# Altium schematic sheet Power_supplies.SchDoc
size A4
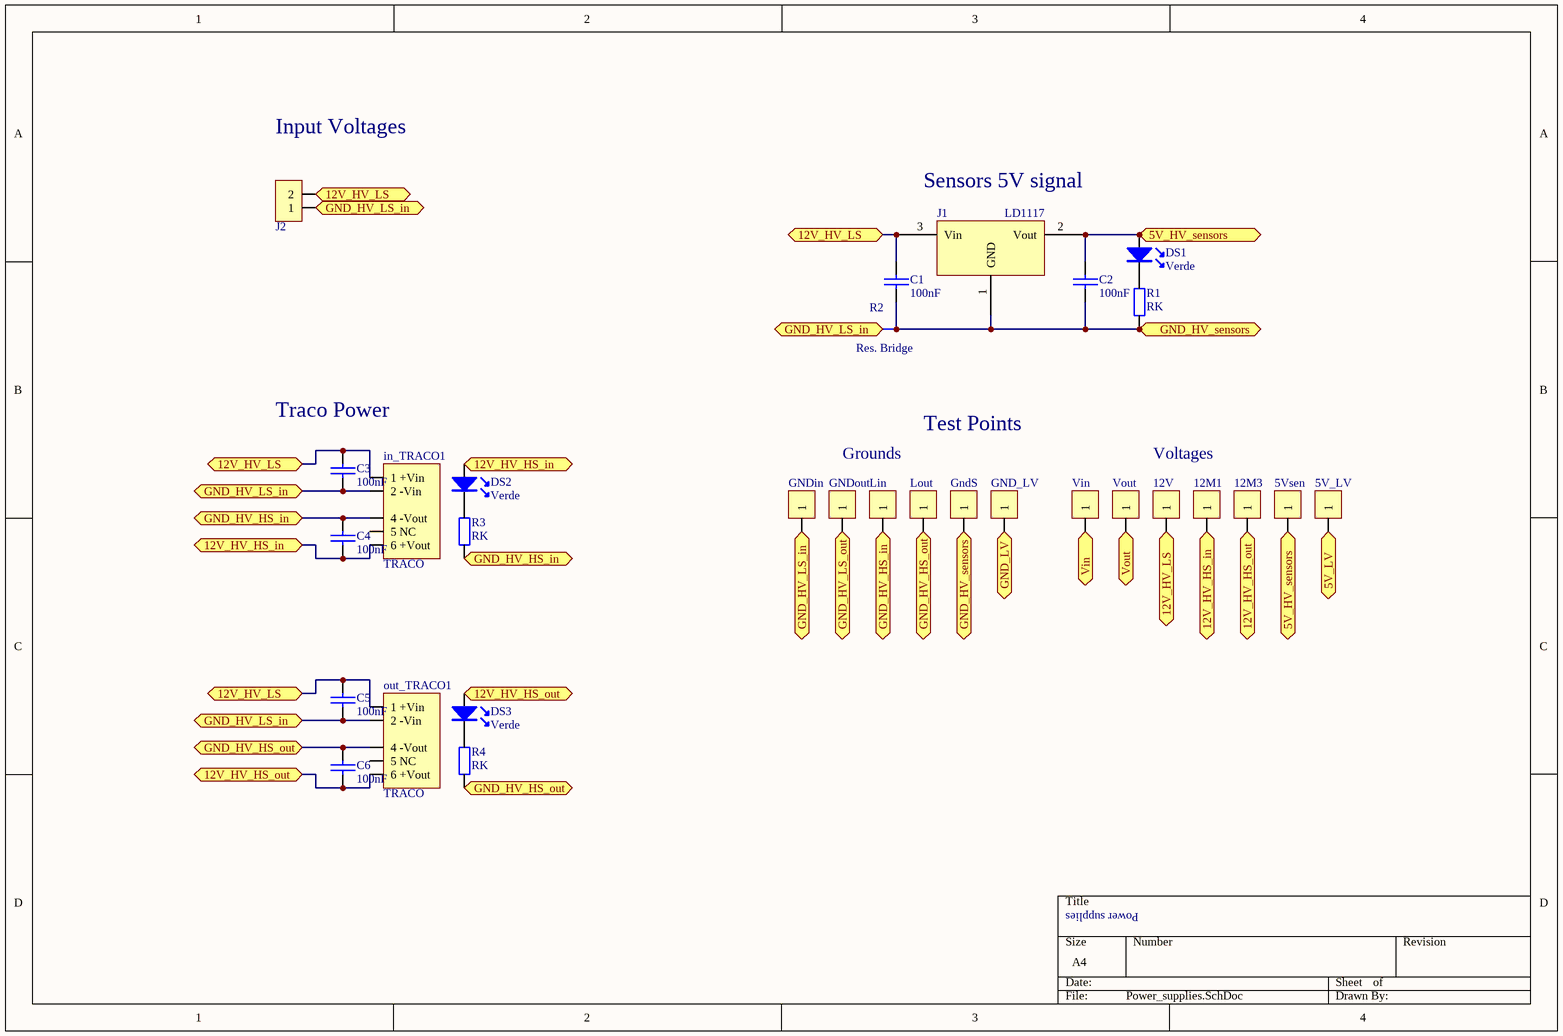
[diagram p0: Power_supplies.SchDoc]

## Parts
5V_LV  Test Point  [Test_Point]  (value not drawn)
5Vsen  Test Point  [Test_Point]  (value not drawn)
12M1  Test Point  [Test_Point]  (value not drawn)
12M3  Test Point  [Test_Point]  (value not drawn)
12V  Test Point  [Test_Point]  (value not drawn)
C1  100nF  [Cap100nF_AAU]
C2  100nF  [Cap100nF_AAU]
C3  100nF  [Cap100nF_AAU]
C4  100nF  [Cap100nF_AAU]
C5  100nF  [Cap100nF_AAU]
C6  100nF  [Cap100nF_AAU]
DS1  Verde  [Led 2mm]
DS2  Verde  [Led 2mm]
DS3  Verde  [Led 2mm]
GND_LV  Test Point  [Test_Point]  (value not drawn)
GNDin  Test Point  [Test_Point]  (value not drawn)
GNDout  Test Point  [Test_Point]  (value not drawn)
GndS  Test Point  [Test_Point]  (value not drawn)
in_TRACO1  TRACO  [TRACO_TMA1212S]
J1  LD1117  [SOT-223_LM1117]
J2  Cleva 2 vias  [Con2_Extron _3.5mmPitch]  (value not drawn)
Lin  Test Point  [Test_Point]  (value not drawn)
Lout  Test Point  [Test_Point]  (value not drawn)
out_TRACO1  TRACO  [TRACO_TMA1212S]
R1  RK  [1206]
R2  Res. Bridge  [1206]
R3  RK  [1206]
R4  RK  [1206]
Vin  Test Point  [Test_Point]  (value not drawn)
Vout  Test Point  [Test_Point]  (value not drawn)

## Ports
5V_HV_sensors, 5V_LV, 12V_HV_HS_in, 12V_HV_HS_out, 12V_HV_LS, GND_HV_HS_in, GND_HV_HS_out, GND_HV_LS_in, GND_HV_LS_out, GND_HV_sensors, GND_LV, Vin, Vout

## Nets
5V_HV_sensors: 5Vsen.1 C2.2 DS1.A J1.2(Vout) ; port 5V_HV_sensors
5V_LV: 5V_LV.1 ; port 5V_LV
12V_HV_HS_in: 12M1.1 C4.1 DS2.A in_TRACO1.6(6_+Vout) ; port 12V_HV_HS_in
12V_HV_HS_out: 12M3.1 C6.1 DS3.A out_TRACO1.6(6_+Vout) ; port 12V_HV_HS_out
12V_HV_LS: 12V.1 C1.2 C3.2 C5.2 in_TRACO1.1(1_+Vin) J1.3(Vin) J2.2 out_TRACO1.1(1_+Vin) ; port 12V_HV_LS
GND_HV_HS_in: C4.2 in_TRACO1.4(4_-Vout) Lin.1 R3.2 ; port GND_HV_HS_in
GND_HV_HS_out: C6.2 Lout.1 out_TRACO1.4(4_-Vout) R4.2 ; port GND_HV_HS_out
GND_HV_LS_in: C3.1 C5.1 GNDin.1 in_TRACO1.2(2_-Vin) J2.1 out_TRACO1.2(2_-Vin) R2.1 ; port GND_HV_LS_in
GND_HV_LS_out: GNDout.1 ; port GND_HV_LS_out
GND_HV_sensors: C1.1 C2.1 GndS.1 J1.1(GND) R1.2 R2.2 ; port GND_HV_sensors
GND_LV: GND_LV.1 ; port GND_LV
Vin: Vin.1 ; port Vin
Vout: Vout.1 ; port Vout
NetDS1_K: DS1.K R1.1
NetDS2_K: DS2.K R3.1
NetDS3_K: DS3.K R4.1

Not connected (* = marked no-connect by the designer): in_TRACO1 5(5_NC); out_TRACO1 5(5_NC)

## Notes on the sheet
- Input Voltages
- Sensors 5V signal
- Traco Power
- Test Points
- Grounds
- Voltages
- Power supplies

## Library data of the parts
C1-C6 = Condensador
DS1-DS3 = Led
in_TRACO1 out_TRACO1 = TRACO: TracoPower TMA1212S
J1 = LD1117: Linear voltage regulator
J2 = Con_2
R1 R3 R4 = Resistencia: Potencia: 1/4W
R2 = Res. Bridge: Resistencia Bridge